# Altium schematic sheet connecteurs.SchDoc: Connecteurs
size A4; DrawnBy: TAHIRI Manelle; Revision: V1.0 REVA; SheetNumber: 3; SheetTotal: 6
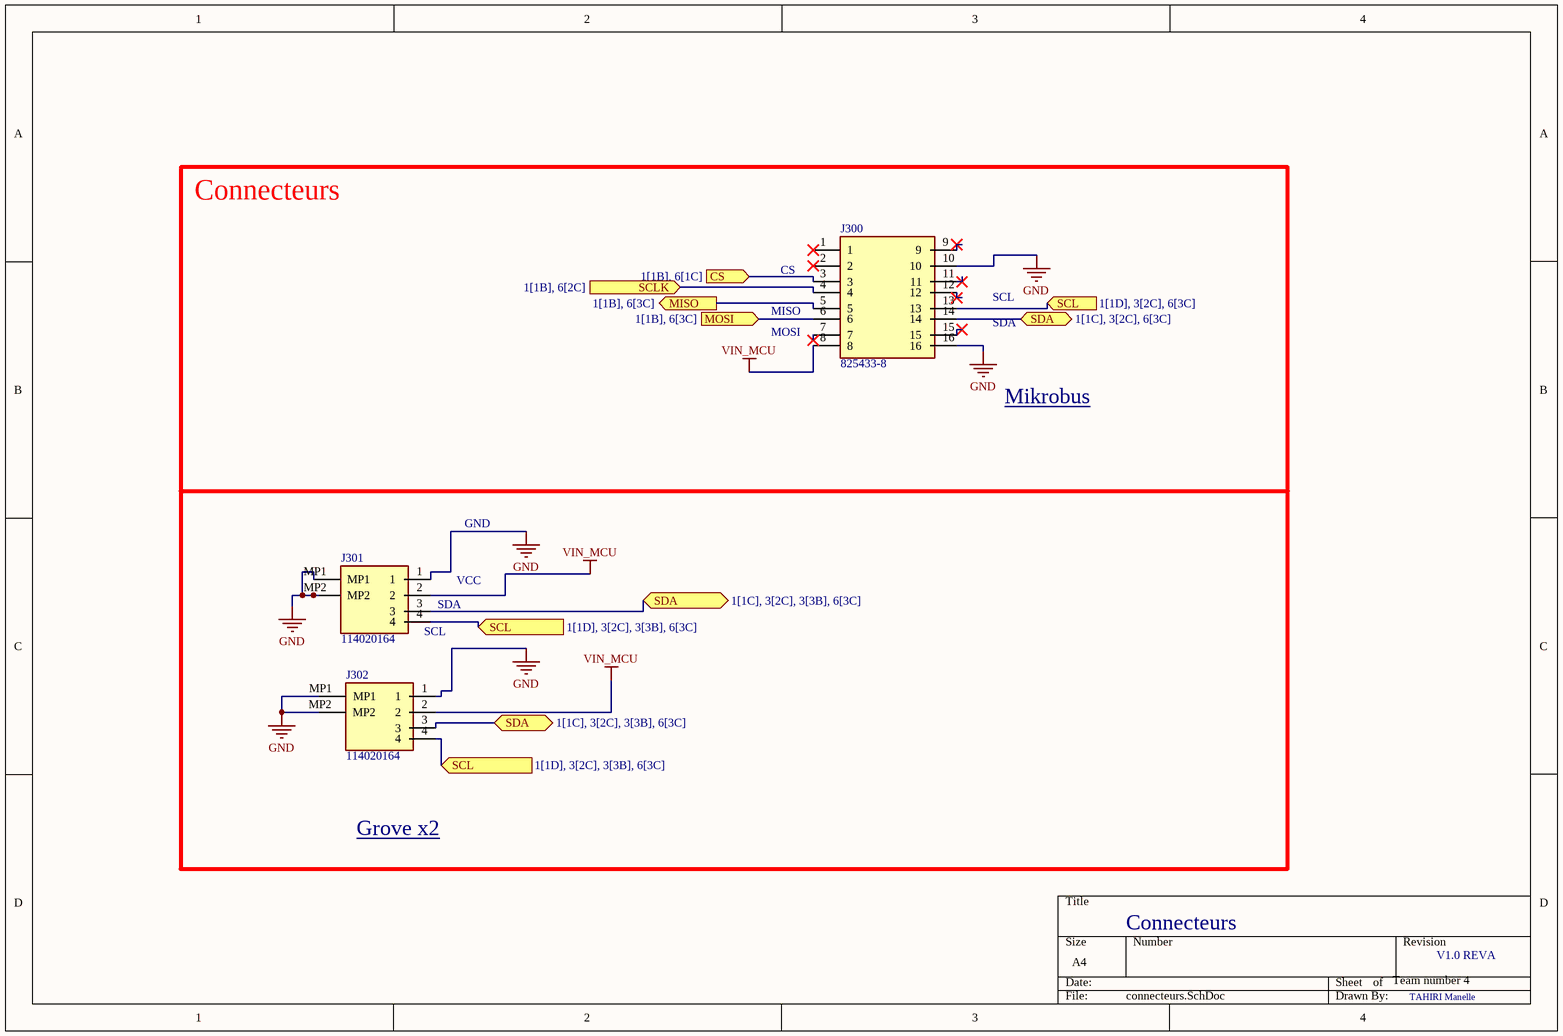
[diagram p0: connecteurs.SchDoc]

## Parts
J300  825433-8
J301  114020164  [114020164]
J302  114020164  [114020164]

## Blocks framed on the sheet
Connecteurs: J300-J302

## Ports
CS (in, see 1[1B], 6[1C]), MISO (out, see 1[1B], 6[3C]), MOSI (in, see 1[1B], 6[3C]), SCL (in, see 1[1D], 3[2C], 3[3B], 6[3C]), SCL (in, see 1[1D], 3[2C], 6[3C]), SCLK (in, see 1[1B], 6[2C]), SDA (bidir, see 1[1C], 3[2C], 3[3B], 6[3C]), SDA (bidir, see 1[1C], 3[2C], 6[3C])

## Nets
GND: J300.10 J300.16 J301.1 J301.MP1 J301.MP2 J302.1 J302.MP1 J302.MP2
VIN_MCU: J300.8 J301.2 J302.2
CS: J300.3 ; port CS
MISO: J300.5 ; port MISO
MOSI: J300.6 ; port MOSI
SCL: J300.13 J301.4 J302.4 ; port SCL
SCLK: J300.4 ; port SCLK
SDA: J300.14 J301.3 J302.3 ; port SDA

Not connected (* = marked no-connect by the designer): J300 1* 2* 7* 9* 11* 12* 15*

## Notes on the sheet
- (near J300) MISO
- (near J300) CS
- SCL
- (near J300) MOSI
- SDA
- Mikrobus <https://www.mouser.fr/datasheet/2/418/7/ENG_CD_825433_S_baseFilename-2068619.pdf>
- (near J301) VCC
- GND
- (near J301) SCL
- (near J301) SDA
- Grove x2 <https://www.mouser.fr/datasheet/2/744/Grove_Female_Header___SMD_4P_2_0mm_90D_Datasheet-3011316.pdf>
- Team number 4

## Library data of the parts
J300 = Connect-Mikronus: Headers & Wire Housings 8P double for connection mikrobus; Manufacturer_Name: TE Connectivity; Manufacturer_Part_Number: 825433-8; Mouser Part Number: 571-825433-8
J301 J302 = 114020164: Seeed Studio Accessories Grove Female Header - SMD-4P-2.0mm-90D-20Pcs; Manufacturer_Name: Seeed Studio; Manufacturer_Part_Number: 114020164; Mouser Part Number: 713-114020164